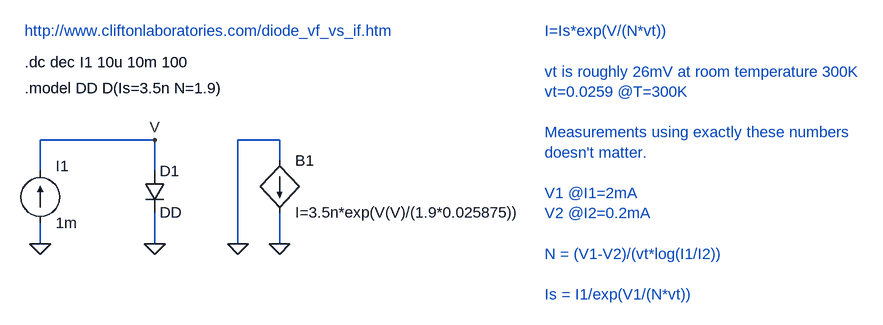
[diagram p0: schematic 1N4148_Is_N.asc]
1N4148_Is_N.asc, the LTspice schematic file:
Version 4
SHEET 1 1588 680
WIRE 272 96 96 96
WIRE 464 96 400 96
WIRE 464 128 464 96
WIRE 96 144 96 96
WIRE 272 144 272 96
WIRE 96 256 96 224
WIRE 272 256 272 208
WIRE 400 256 400 96
WIRE 464 256 464 208
FLAG 272 256 0
FLAG 96 256 0
FLAG 272 96 V
FLAG 400 256 0
FLAG 464 256 0
SYMBOL diode 256 144 R0
SYMATTR InstName D1
SYMATTR Value DD
SYMBOL current 96 224 M180
WINDOW 0 24 88 Left 0
WINDOW 3 24 0 Left 0
SYMATTR InstName I1
SYMATTR Value 1m
SYMBOL bi 464 128 R0
SYMATTR InstName B1
SYMATTR Value I=3.5n*exp(V(V)/(1.9*0.025875))
TEXT 72 16 Left 0 !.model DD D(Is=3.5n N=1.9)
TEXT 72 -24 Left 0 !.dc dec I1 10u 10m 100
TEXT 72 -72 Left 0 ;http://www.cliftonlaboratories.com/diode_vf_vs_if.htm
TEXT 872 -72 Left 0 ;I=Is*exp(V/(N*vt))  \n \nvt is roughly 26mV at room temperature 300K\nvt=0.0259 @T=300K\n \nMeasurements using exactly these numbers \ndoesn't matter.\n \nV1 @I1=2mA\nV2 @I2=0.2mA\n \nN = (V1-V2)/(vt*log(I1/I2)) \n \nIs = I1/exp(V1/(N*vt))

The netlist it stands for:
* 1N4148_Is_N.asc
D1 V 0 DD
I1 0 V 1m
B1 0 0 I=3.5n*exp(V(V)/(1.9*0.025875))
.model D D
.lib standard.dio
.model DD D(Is=3.5n N=1.9)
.dc dec I1 10u 10m 100
* http://www.cliftonlaboratories.com/diode_vf_vs_if.htm
* I=Is*exp(V/(N*vt))
* vt is roughly 26mV at room temperature 300K
* vt=0.0259 @T=300K
* Measurements using exactly these numbers
* doesn't matter.
* V1 @I1=2mA
* V2 @I2=0.2mA
* N = (V1-V2)/(vt*log(I1/I2))
* Is = I1/exp(V1/(N*vt))
.backanno
.end